# EAGLE design Wisp5_Harvester_Motor-driver (EAGLE 7.7.0)

## Sheet 1 of 2
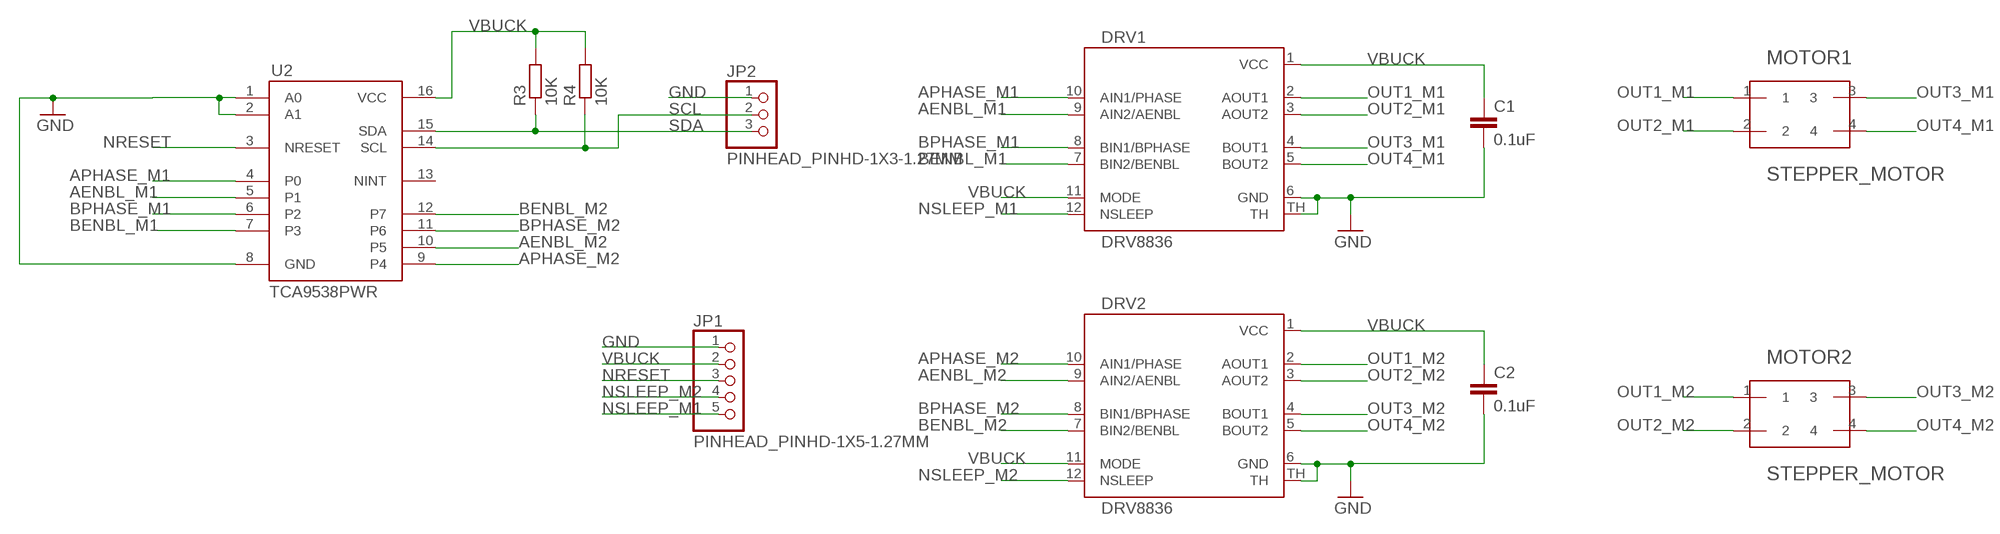
[diagram p0: schematic, sheet 1]

### Parts
C1  0.1uF  C-EUC0805  [C0805]
C2  0.1uF  C-EUC0805  [C0805]
DRV1  DRV8836  [12WSON]
DRV2  DRV8836  [12WSON]
JP1  PINHEAD_PINHD-1X5-1.27MM  [PINHEAD_1X05-1.27MM]
JP2  PINHEAD_PINHD-1X3-1.27MM  [PINHEAD_1X03-1.27MM]
MOTOR1  STEPPER_MOTOR  [STEPPER_MOTOR]
MOTOR2  STEPPER_MOTOR  [STEPPER_MOTOR]
R3  10K  R-EU_R0805  [R0805]
R4  10K  R-EU_R0805  [R0805]
U2  TCA9538PWR  [TSSOP16]

### Nets
AENBL_M1: DRV1.9(AIN2/AENBL) U2.5(P1)
AENBL_M2: DRV2.9(AIN2/AENBL) U2.10(P5)
APHASE_M1: DRV1.10(AIN1/PHASE) U2.4(P0)
APHASE_M2: DRV2.10(AIN1/PHASE) U2.9(P4)
BENBL_M1: DRV1.7(BIN2/BENBL) U2.7(P3)
BENBL_M2: DRV2.7(BIN2/BENBL) U2.12(P7)
BPHASE_M1: DRV1.8(BIN1/BPHASE) U2.6(P2)
BPHASE_M2: DRV2.8(BIN1/BPHASE) U2.11(P6)
GND: C1.2 C2.2 DRV1.6(GND) DRV1.TH DRV2.6(GND) DRV2.TH JP1.1 JP2.1 U2.1(A0) U2.2(A1) U2.8(GND) ; also sheet 2
NRESET: JP1.3 U2.3(NRESET)
NSLEEP_M1: DRV1.12(NSLEEP) JP1.5
NSLEEP_M2: DRV2.12(NSLEEP) JP1.4
OUT1_M1: DRV1.2(AOUT1) MOTOR1.1
OUT1_M2: DRV2.2(AOUT1) MOTOR2.1
OUT2_M1: DRV1.3(AOUT2) MOTOR1.2
OUT2_M2: DRV2.3(AOUT2) MOTOR2.2
OUT3_M1: DRV1.4(BOUT1) MOTOR1.3
OUT3_M2: DRV2.4(BOUT1) MOTOR2.3
OUT4_M1: DRV1.5(BOUT2) MOTOR1.4
OUT4_M2: DRV2.5(BOUT2) MOTOR2.4
SCL: JP2.2 R4.1 U2.14(SCL)
SDA: JP2.3 R3.1 U2.15(SDA)
VBUCK: C1.1 C2.1 DRV1.1(VCC) DRV1.11(MODE) DRV2.1(VCC) DRV2.11(MODE) JP1.2 R3.2 R4.2 U2.16(VCC) ; also sheet 2
Unconnected: U2.13(NINT)

## Sheet 2 of 2
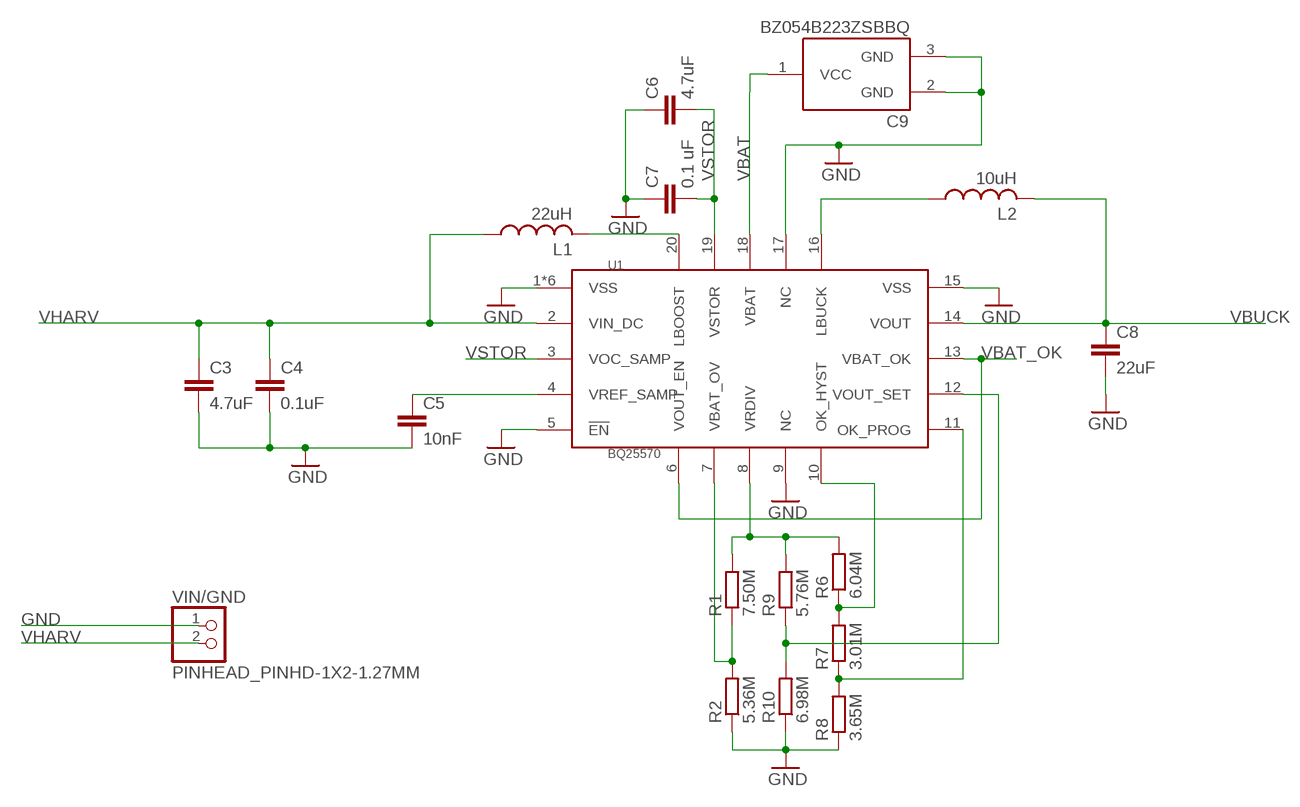
[diagram p1: schematic, sheet 2]

### Parts
C3  4.7uF  C-EUC0805  [C0805]
C4  0.1uF  C-EUC0805  [C0805]
C5  10nF  C-EUC0805  [C0805]
C6  4.7uF  C-EUC0805  [C0805]
C7  0.1 uF  C-EUC0805  [C0805]
C8  22uF  C-EUC0805  [C0805]
C9  BZ054B223ZSBBQ  [BZ05_S-STYLE]
L1  22uH  COILCRAFT-LPS4018  [LPS4018]
L2  10uH  COILCRAFT-LPS4018  [LPS4018]
R1  7.50M  R-EU_R0805  [R0805]
R2  5.36M  R-EU_R0805  [R0805]
R6  6.04M  R-EU_R0805  [R0805]
R7  3.01M  R-EU_R0805  [R0805]
R8  3.65M  R-EU_R0805  [R0805]
R9  5.76M  R-EU_R0805  [R0805]
R10  6.98M  R-EU_R0805  [R0805]
U1  BQ25570  [VQFN20]
VIN/GND  PINHEAD_PINHD-1X2-1.27MM  [PINHEAD_1X02-1.27MM]

### Nets
GND: C3.2 C4.2 C5.2 C6.1 C7.1 C8.2 C9.2(GND) C9.3(GND) R2.1 R8.1 R10.1 U1.1(VSS) U1.5(!EN) U1.9(NC) U1.15(VSS) U1.17(NC) U1.PWR_PAD1(VSS) U1.PWR_PAD2(VSS) U1.PWR_PAD3(VSS) U1.PWR_PAD4(VSS) U1.PWR_PAD(VSS) VIN/GND.1 ; also sheet 1
N$1: R9.1 R10.2 U1.12(VOUT_SET)
N$2: R1.2 R6.2 R9.2 U1.8(VRDIV)
N$4: L1.2 U1.20(LBOOST)
N$9: C5.1 U1.4(VREF_SAMP)
N$10: R6.1 R7.2 U1.10(OK_HYST)
N$12: L2.1 U1.16(LBUCK)
N$13: R1.1 R2.2 U1.7(VBAT_OV)
N$18: R7.1 R8.2 U1.11(OK_PROG)
VBAT: C9.1(VCC) U1.18(VBAT)
VBAT_OK: U1.6(VOUT_EN) U1.13(VBAT_OK)
VBUCK: C8.1 L2.2 U1.14(VOUT) ; also sheet 1
VHARV: C3.1 C4.1 L1.1 U1.2(VIN_DC) VIN/GND.2
VSTOR: C6.2 C7.2 U1.3(VOC_SAMP) U1.19(VSTOR)

## Library data of the parts
C1-C8 = rcl:C-EU: CAPACITOR, European symbol
C9 = ipr:BZ054B223ZSBBQ
DRV1 DRV2 = ipr:DRV8836: Dual low voltage H-Bridge IC
JP1 = transceiver:PINHEAD_PINHD-1X5-1.27MM
JP2 = transceiver:PINHEAD_PINHD-1X3-1.27MM: PIN HEADER
L1 L2 = passives:COILCRAFT-LPS4018: Coilcraft Shielded SMT Power Inductors � LPS4018 Series
MOTOR1 MOTOR2 = ipr:STEPPER_MOTOR
R1-R4 R6-R10 = resistor:R-EU_: RESISTOR, European symbol
U1 = texas:BQ25570
U2 = ipr:TCA9538PWR: I2C I/O EXPANDER
VIN/GND = transceiver:PINHEAD_PINHD-1X2-1.27MM

## Board
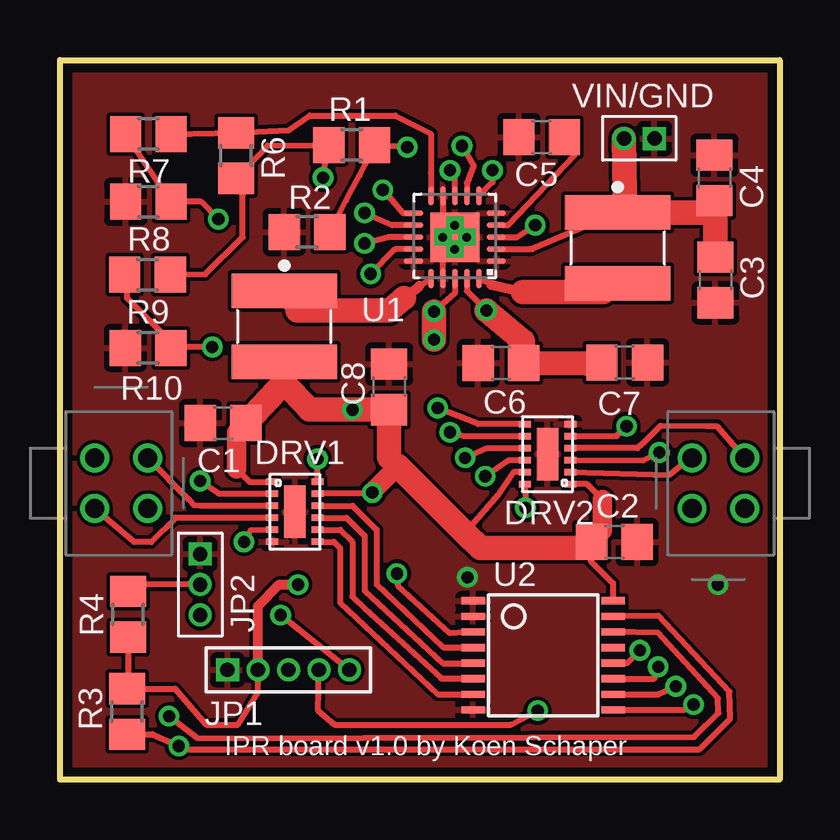
[diagram p2: board, top side]
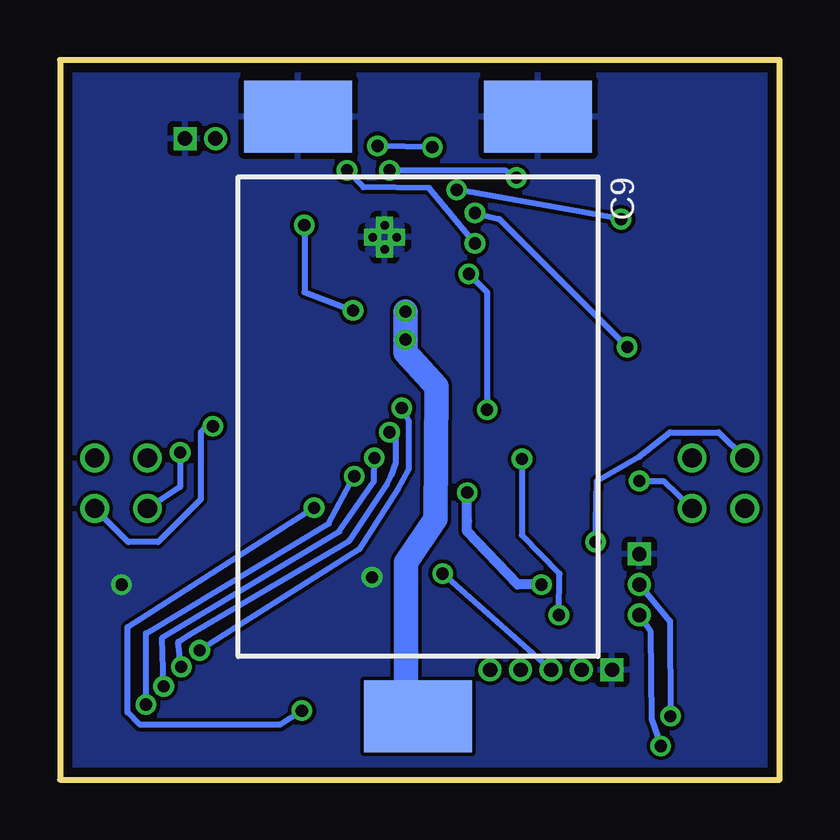
[diagram p3: board, bottom side, seen from below]

Size 30 x 30 mm. Coordinates in mm from the lower left corner, seen from the top.
Outline: 0,0 0,30 30,30 30,0 0,0
Copper layers (1*16): Top 0.0356mm / dielectric 1.5011mm / Bottom 0.0356mm
Design rules "oshpark-2layer *": minimum track width 6mil, minimum drill 13mil, track to track 6mil, track to pad 6mil, pad to pad 6mil, via to via 6mil, smd to smd 6mil, copper to edge 15mil, drill to drill 6mil, minimum pad ring 7mil, minimum via ring 7mil, stop-mask expansion 2.5mil, vias tented up to drill 20mil, thermal gap 10mil

### Footprints (pad centres in the part's own frame; a part is rotated, then mirrored left to right if it is on the bottom)
C0805 = smd 1.3 x 1.5: 1 -0.95,0; 2 0.95,0
BZ05_S-STYLE = smd 3 x 4.5: 1 12.5,0; 2 -12.5,5; 3 -12.5,-5
12WSON = smd 0.28 x 0.5: 1 -1.25,-0.95; 2 -0.75,-0.95; 3 -0.25,-0.95; 4 0.25,-0.95; 5 0.75,-0.95; 6 1.25,-0.95; 7 1.25,0.95; 8 0.75,0.95; 9 0.25,0.95; 10 -0.25,0.95; 11 -0.75,0.95; 12 -1.25,0.95 | smd 2.2 x 0.9: TH 0,0
PINHEAD_1X05-1.27MM = drill 0.6 square: 1 -2.54,0 | drill 0.6: 2 -1.27,0; 3 0,0; 4 1.27,0; 5 2.54,0
PINHEAD_1X03-1.27MM = drill 0.6 square: 1 -2.54,0 | drill 0.6: 2 -1.27,0; 3 0,0
LPS4018 = smd 1.435 x 4.394: 1 -1.48,0; 2 1.48,0
STEPPER_MOTOR = drill 0.8: 1 -2,1.05; 2 -2,-1.05; 3 0.2,1.05; 4 0.2,-1.05
R0805 = smd 1.3 x 1.5: 1 -0.95,0; 2 0.95,0
VQFN20 = smd 0.8 x 0.23: 1 -1.725,1; 2 -1.725,0.5; 3 -1.725,0; 4 -1.725,-0.5; 5 -1.725,-1; 11 1.725,-1; 12 1.725,-0.5; 13 1.725,0; 14 1.725,0.5; 15 1.725,1 | smd 0.23 x 0.8: 6 -1,-1.725; 7 -0.5,-1.725; 8 0,-1.725; 9 0.5,-1.725; 10 1,-1.725; 16 1,1.725; 17 0.5,1.725; 18 0,1.725; 19 -0.5,1.725; 20 -1,1.725 | smd 2.05 x 2.05: PWR_PAD 0,0 | drill 0.35 square: PWR_PAD1 0,0.5; PWR_PAD2 -0.5,0; PWR_PAD3 0.5,0; PWR_PAD4 0,-0.5
TSSOP16 = smd 0.305 x 0.991: 1 -2.275,-2.918; 2 -1.625,-2.918; 3 -0.975,-2.918; 4 -0.325,-2.918; 5 0.325,-2.918; 6 0.975,-2.918; 7 1.625,-2.918; 8 2.275,-2.918; 9 2.275,2.918; 10 1.625,2.918; 11 0.975,2.918; 12 0.325,2.918; 13 -0.325,2.918; 14 -0.975,2.918; 15 -1.625,2.918; 16 -2.275,2.918
PINHEAD_1X02-1.27MM = drill 0.6 square: 1 0,0 | drill 0.6: 2 1.27,0

### Placement (x,y rotation side)
C1  6.8,14.86 180 top
C2  23.11,9.91 0 top
C3  27.33,20.83 270 top
C4  27.29,25.08 90 top
C5  20.08,26.78 180 top
C6  18.38,17.36 0 top
C7  23.55,17.39 180 top
C8  13.73,16.37 90 top
C9  15.07,15.13 270 bottom
DRV1  9.8,11.16 270 top
DRV2  20.33,13.57 90 top
JP1  9.53,4.57 0 top
JP2  5.84,6.86 270 top
L1  23.25,22.16 270 top
L2  9.35,18.89 270 top
MOTOR1  1.65,12.35 180 top
MOTOR2  28.35,12.35 0 top
R1  12.16,26.45 180 top
R2  10.3,22.82 0 top
R3  2.8,2.84 90 top
R4  2.84,6.89 270 top
R6  7.34,26.01 270 top
R7  3.69,26.92 0 top
R8  3.69,24.09 0 top
R9  3.65,21.04 0 top
R10  3.68,18 0 top
U1  16.47,22.61 180 top
U2  20.14,5.18 270 top
VIN/GND  24.79,26.73 180 top

### Tracks (layer width: path | path; a pad name or v marks a point on that pad's centre or on a via)
AENBL_M1
  Top 0.254: DRV1.9 11.95,10.91 12.7,10.16 12.7,7.87 15.95,4.85 17.15,4.85 U2.5
AENBL_M2  (via drill 0.51)
  Top 0.254: U2.10 24.96,3.55 v25.68,3.89 | v16.89,13.41 17.8,13.82 DRV2.9
  Bottom 0.254: v25.68,3.89 25.73,5.92 18.36,10.34 16.92,12.42 v16.89,13.41
APHASE_M1
  Top 0.254: DRV1.10 12.21,11.41 13.21,10.41 13.21,8.13 15.98,5.51 17.12,5.51 U2.4
APHASE_M2  (via drill 0.51)
  Top 0.254: U2.9 26.02,2.9 v26.42,3.12 | v17.73,12.65 18.7,13.32 DRV2.10
  Bottom 0.254: v26.42,3.12 26.42,6.1 18.8,10.67 v17.73,12.65
BENBL_M1
  Top 0.254: DRV1.7 11.42,9.91 11.68,9.65 11.68,7.37 15.75,3.56 U2.7
BENBL_M2  (via drill 0.51)
  Top 0.254: DRV2.7 17.44,14.82 v15.75,15.49 | v24.18,5.38 23.65,4.85 U2.12
  Bottom 0.254: v15.75,15.49 15.47,14.96 15.47,12.93 15.93,12.09 17.53,9.6 v24.18,5.38
BPHASE_M1
  Top 0.254: DRV1.8 11.68,10.41 12.19,9.91 12.19,7.62 12.72,7.11 15.9,4.22 17.16,4.22 U2.6
BPHASE_M2  (via drill 0.51)
  Top 0.254: U2.11 24.78,4.2 v24.94,4.7 | v16.26,14.48 16.86,14.32 DRV2.8
  Bottom 0.254: v24.94,4.7 25.07,5.74 24.59,6.04 17.96,9.96 16.38,12.29 16.2,12.68 16,13.21 16,14.22 v16.26,14.48
GND  (via drill 0.51)
  Top 0.254: U1.9 15.97,23.61 U1.PWR_PAD4 | U1.17 15.97,21.61 U1.PWR_PAD1
  other vias: 16.99,8.43 27.43,8.13
  pour Bottom: 0,0 0,30 30,30 30,0
  pour Top: 0,30 30,30 30,0 0,0
N$1  (via drill 0.51)
  Top 0.254: R9.1 2.79,20.95 2.79,20.07 4.63,18.23 R10.2 4.67,18.03 v6.35,18.03 | U1.12 13.85,23.11 v12.7,23.62
  Bottom 0.254: v12.7,23.62 11.68,23.37 v6.35,18.03
N$2  (via drill 0.51)
  Top 0.254: R9.2 6.06,21.07 7.62,22.61 7.62,24.37 R6.2 8.65,26.43 R1.2 11.18,26.42 v10.97,25.09 | U1.8 16.47,25.19 v16.26,25.4
  Bottom 0.254: v16.26,25.4 11.43,25.4 v10.97,25.09
N$4
  Top 0.254: U1.20 17.98,20.63
  Top 0.406: 17.98,20.63 19.3,20.32
  Top 0.813: 22.63,20.32 L1.2
  Top 1.016: 19.3,20.32 22.63,20.32
N$9
  Top 0.254: U1.4 18.5,23.11 18.67,23.11 21.46,26.06 21.46,26.45 C5.1
N$10
  Top 0.254: R7.2 R6.1 9.54,27.06 10.41,27.69 13.97,27.69 15.47,26.92 15.47,25.3 U1.10
N$12
  Top 0.254: 14.99,20.57 U1.16
  Top 0.406: 14.35,20.07 14.99,20.57
  Top 0.813: 9.91,19.56 L2.1
  Top 1.016: 9.91,19.56 13.72,19.56 14.35,20.07
N$13  (via drill 0.51)
  Top 0.254: R2.2 11.94,24.15 12.5,25.2 13.13,26.43 | 13.13,26.43 R1.1 | 13.13,26.43 14.14,26.41 v14.48,26.36 | v16.76,26.42 17.25,25.6 16.97,24.87 U1.7
  Bottom 0.254: v14.48,26.36 v16.76,26.42
N$18  (via drill 0.51)
  Top 0.254: R7.1 R8.2 5.89,24.09 v6.6,23.37 | v13.46,24.59 14.3,23.62 U1.11
  Bottom 0.254: v6.6,23.37 v13.46,24.59
NRESET  (via drill 0.51)
  Top 0.254: U2.3 16.26,6.1 14.1,8.08 v14.05,8.59
  Bottom 0.254: v14.05,8.59 JP1.3
NSLEEP_M1  (via drill 0.51)
  Top 0.254: DRV1.12 v10.74,13.36 | v9.2,6.86 JP1.5
  Bottom 0.254: v9.2,6.86 9.17,8.59 10.75,10.2 v10.74,13.36
NSLEEP_M2  (via drill 0.51)
  Top 0.254: JP1.4 10.77,2.87 11.46,2.29 18.8,2.29 v19.91,2.87 | DRV2.12 19.4,11.5 v19.41,11.33
  Bottom 0.254: v19.91,2.87 20.83,2.29 26.67,2.29 27.18,2.79 27.18,6.35 v19.41,11.33
OUT1_M1  (via drill 0.51)
  Top 0.254: DRV1.2 6.63,11.91 v5.84,12.45
  Bottom 0.254: v5.84,12.45 4.84,12.45 MOTOR1.1
OUT1_M2
  Top 0.254: MOTOR2.1 25.86,13.07 25.4,12.7 DRV2.2
OUT2_M1
  Top 0.254: DRV1.3 5.86,11.41 5.59,11.43 5.37,11.68 MOTOR1.2
OUT2_M2  (via drill 0.51)
  Top 0.254: DRV2.3 24.33,13.31 v24.99,13.64
  Bottom 0.254: v24.99,13.64 24.99,12.19 MOTOR2.2
OUT3_M1
  Top 0.254: MOTOR1.3 3.1,9.91 3.81,9.91 4.82,10.91 DRV1.4
OUT3_M2
  Top 0.254: MOTOR2.3 28.6,13.35 27.38,14.73 27,14.73 25.04,14.76 24.38,14.1 24.08,13.82 DRV2.4
OUT4_M1  (via drill 0.51)
  Top 0.254: DRV1.5 7.95,10.39 v7.67,9.91
  Bottom 0.254: v7.67,9.91 7.62,12.45 5.84,13.46 4.57,14.48 2.54,14.48 MOTOR1.4
OUT4_M2  (via drill 0.51)
  Top 0.254: DRV2.5 23.21,14.32 v23.62,14.73
  Bottom 0.254: v23.62,14.73 23.88,14.73 24.13,14.48 24.13,11.68 25.91,9.91 27.15,9.91 MOTOR2.4
SCL  (via drill 0.51)
  Top 0.254: JP2.2 3.38,8.13 R4.1 | U2.14 24.92,6.12 27.43,3.38 27.46,2.77 26.44,1.78 5.74,1.73 v4.55,2.64
  Bottom 0.254: JP2.2 4.57,6.6 v4.55,2.64
SDA  (via drill 0.51)
  Top 0.254: R3.1 3.85,1.89 v4.95,1.4 5.08,1.27 26.67,1.27 27.94,2.54 27.91,3.66 24.94,6.83 23.12,6.81 U2.15
  Bottom 0.254: JP2.3 5.38,6.17 5.33,2.54 v4.95,1.4
VBAT  (via drill 0.51)
  Top 0.254: U1.18 16.47,20.28 v15.6,19.51
  Top 1.016: v15.6,19.51 v15.6,18.34
  Bottom 0.254: C9.1 15.24,2.8
  Bottom 1.016: C9.1 15.58,3.14 15.58,9.06 14.35,10.87 14.3,16.38 15.6,17.8 v15.6,18.34 v15.6,19.51
VBAT_OK  (via drill 0.51)
  Top 0.254: U1.13 13.72,22.61 v12.7,22.35 | v18.03,25.4 18.03,24.9 U1.6
  Bottom 0.254: v12.7,22.35 13.97,23.88 14.61,24.66 17.35,24.69 v18.03,25.4
VBUCK  (via drill 0.51)
  Top 0.254: R4.2 2.84,3.6 R3.2 4.8,3.79 6.1,2.29 7.42,2.29 8.26,3.63 JP1.2 | 7.37,12.95 7.91,12.41 DRV1.1 | 22.61,11.68 21.97,12.32 DRV2.1 | DRV2.11 18.91,12.82 18.26,11.86 16.89,10.29 | 22.12,9.65 22.12,9.12 23.06,8.18 U2.16 | DRV1.11 10.72,11.94 | 10.72,11.94 10.67,11.94 | U1.14 13.98,22.11 v12.95,21.08 | 10.72,11.94 12.8,11.94 v13.03,11.96 13.03,12.01
  Top 0.406: JP1.2 8.26,7.24 9.14,8.13 v9.93,8.13
  Top 0.813: C1.1 7.37,14.47 7.37,12.95 | 13.73,13.45 14.1,13.08 13.03,12.01 | 22.12,9.65 C2.1 22.61,10.39 22.61,11.68 | v12.19,15.42
  Top 1.016: L2.2 9.35,16.56 | 9.35,16.56 10.41,15.42 v12.19,15.42 C8.1 13.73,13.45 | C1.1 9.35,16.56 | 14.1,13.08 16.89,10.29 17.53,9.65 22.12,9.65
  Bottom 0.254: v12.95,21.08 12.19,20.32 v12.19,15.42 | v12.19,15.42
  Bottom 0.406: v9.93,8.13 10.92,8.13 13.03,10.34 13.03,10.76 v13.03,11.96
VHARV
  Top 0.254: U1.2 19.55,22.11 | 19.55,22.11 19.56,22.1 | L1.1 19.68,22.11 19.55,22.11
  Top 0.813: C4.1 27.33,24.09
  Top 1.016: VIN/GND.2 23.55,24.4 L1.1 26.8,23.64 C4.1 | 27.33,24.09 C3.1
VSTOR  (via drill 0.51)
  Top 0.254: U1.19 16.97,20.37 v17.78,19.56 | U1.3 19.05,22.61 v19.81,23.11
  Top 0.813: 21.94,17.34 C7.2
  Top 1.016: 21.94,17.34 C6.2 19.3,18.29 v17.78,19.56
  Bottom 0.254: v19.81,23.11 19.81,20.32 v17.78,19.56

### Text on the board
tPlace: IPR board v1.0 by Koen Schaper